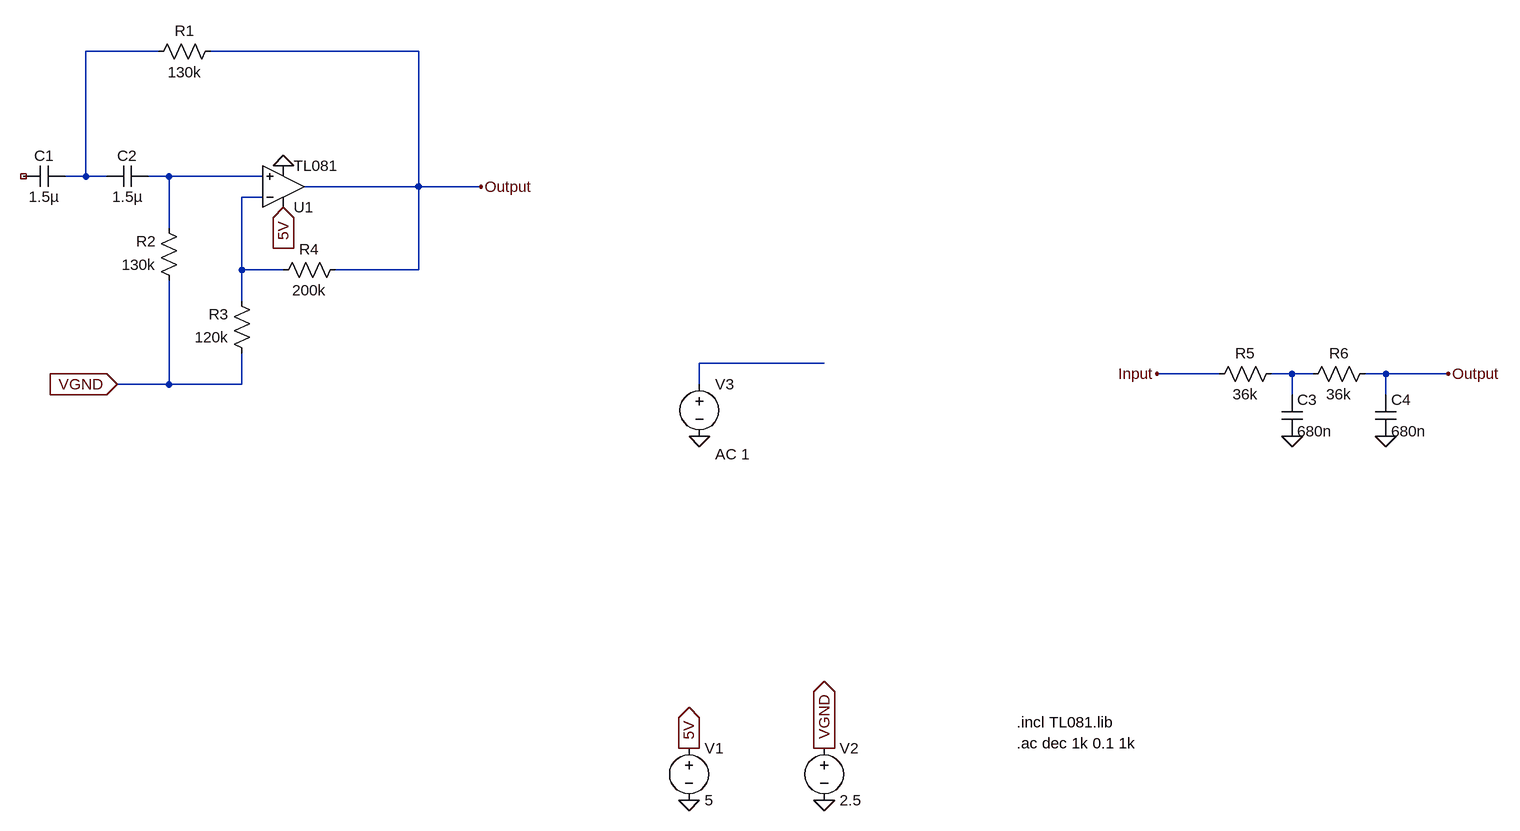
[diagram p0: schematic Filters.asc]
Filters.asc, the LTspice schematic file:
Version 4
SHEET 1 1384 680
WIRE -1648 -672 -1760 -672
WIRE -1248 -672 -1568 -672
WIRE -1760 -480 -1760 -672
WIRE -1760 -480 -1792 -480
WIRE -1728 -480 -1760 -480
WIRE -1632 -480 -1664 -480
WIRE -1488 -480 -1632 -480
WIRE -1248 -464 -1248 -672
WIRE -1248 -464 -1424 -464
WIRE -1152 -464 -1248 -464
WIRE -1488 -448 -1520 -448
WIRE -1632 -400 -1632 -480
WIRE -1520 -336 -1520 -448
WIRE -1456 -336 -1520 -336
WIRE -1248 -336 -1248 -464
WIRE -1248 -336 -1376 -336
WIRE -1520 -288 -1520 -336
WIRE -624 -192 -816 -192
WIRE -16 -176 -112 -176
WIRE 96 -176 64 -176
WIRE 128 -176 96 -176
WIRE 240 -176 208 -176
WIRE 336 -176 240 -176
WIRE -1632 -160 -1632 -320
WIRE -1632 -160 -1712 -160
WIRE -1520 -160 -1520 -208
WIRE -1520 -160 -1632 -160
WIRE -816 -160 -816 -192
WIRE 96 -144 96 -176
WIRE 240 -144 240 -176
FLAG -832 480 0
FLAG -624 480 0
FLAG -832 400 5V
IOPIN -832 400 Out
FLAG -624 400 VGND
IOPIN -624 400 Out
FLAG -1712 -160 VGND
IOPIN -1712 -160 In
FLAG -1456 -432 5V
IOPIN -1456 -432 In
FLAG -1456 -496 0
FLAG -816 -80 0
FLAG 336 -176 Output
FLAG 96 -80 0
FLAG 240 -80 0
FLAG -112 -176 Input
FLAG -1152 -464 Output
SYMBOL cap -1792 -496 R90
WINDOW 0 0 32 VBottom 2
WINDOW 3 32 32 VTop 2
SYMATTR InstName C1
SYMATTR Value 1.5µ
SYMBOL cap -1664 -496 R90
WINDOW 0 0 32 VBottom 2
WINDOW 3 32 32 VTop 2
SYMATTR InstName C2
SYMATTR Value 1.5µ
SYMBOL res -1552 -688 R90
WINDOW 0 0 56 VBottom 2
WINDOW 3 32 56 VTop 2
SYMATTR InstName R1
SYMATTR Value 130k
SYMBOL res -1616 -304 R180
WINDOW 0 36 76 Left 2
WINDOW 3 36 40 Left 2
SYMATTR InstName R2
SYMATTR Value 130k
SYMBOL res -1504 -192 R180
WINDOW 0 36 76 Left 2
WINDOW 3 36 40 Left 2
SYMATTR InstName R3
SYMATTR Value 120k
SYMBOL res -1472 -320 R270
WINDOW 0 32 56 VTop 2
WINDOW 3 0 56 VBottom 2
SYMATTR InstName R4
SYMATTR Value 200k
SYMBOL Opamps\\opamp2 -1456 -400 M180
SYMATTR InstName U1
SYMATTR Value TL081
SYMBOL voltage -832 384 R0
WINDOW 123 0 0 Left 0
WINDOW 39 0 0 Left 0
SYMATTR InstName V1
SYMATTR Value 5
SYMBOL voltage -624 384 R0
WINDOW 123 0 0 Left 0
WINDOW 39 0 0 Left 0
SYMATTR InstName V2
SYMATTR Value 2.5
SYMBOL voltage -816 -176 R0
WINDOW 123 24 124 Left 2
WINDOW 39 0 0 Left 0
SYMATTR Value2 AC 1
SYMATTR InstName V3
SYMATTR Value ""
SYMBOL res 80 -192 R90
WINDOW 0 0 56 VBottom 2
WINDOW 3 32 56 VTop 2
SYMATTR InstName R5
SYMATTR Value 36k
SYMBOL res 224 -192 R90
WINDOW 0 0 56 VBottom 2
WINDOW 3 32 56 VTop 2
SYMATTR InstName R6
SYMATTR Value 36k
SYMBOL cap 80 -144 R0
SYMATTR InstName C3
SYMATTR Value 680n
SYMBOL cap 224 -144 R0
SYMATTR InstName C4
SYMATTR Value 680n
TEXT -328 360 Left 2 !.incl TL081.lib
TEXT -328 392 Left 2 !.ac dec 1k 0.1 1k

The netlist it stands for:
* Filters.asc
C1 N001 NC_01 1.5µ
C2 N002 N001 1.5µ
R1 Output N001 130k
R2 VGND N002 130k
R3 VGND N003 120k
R4 N003 Output 200k
XU1 N002 N003 5V 0 Output TL081  ; pins In+ In- V+ V- OUT
V1 5V 0 5
V2 VGND 0 2.5
V3 N004 0 AC 1
R5 N005 Input 36k
R6 Output N005 36k
C3 N005 0 680n
C4 Output 0 680n
.incl TL081.lib
.ac dec 1k 0.1 1k
.backanno
.end